# Altium schematic sheet Raspberry Pi.SchDoc
size A4; SheetNumber: 10; SheetTotal: 10
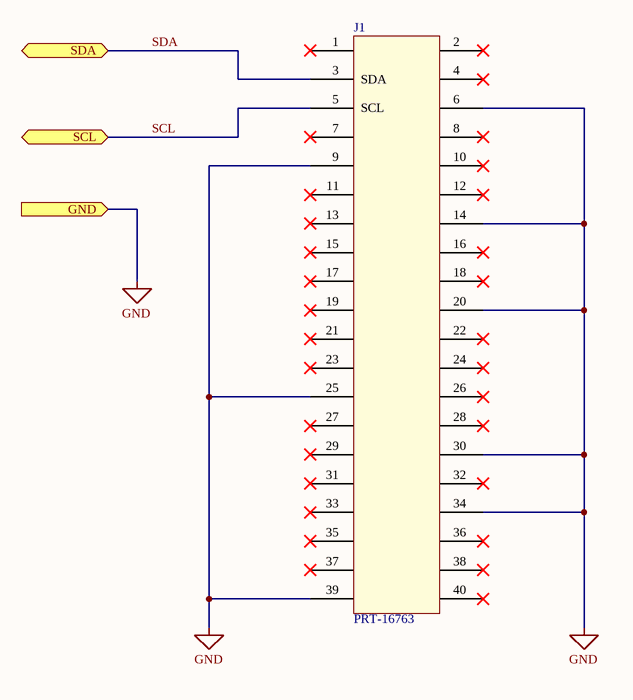
[diagram p0: Raspberry Pi.SchDoc]

## Parts
J1  PRT-16763  [FP-SFH11-PBPC-D20-ST-BK-MFG]

## Ports
GND (in, see Callisto Control Board[7A], 3V3 LDO[3B], INA219_CH1[1A], INA219_CH2[1B], INA219_CH3[1B], INA219_CH4[1B], INA219_CH5[1B], INA219_CH6[1B]), SCL (bidir, see Callisto Control Board[6A], INA219_CH1[1C], INA219_CH2[1C], INA219_CH3[1C], INA219_CH4[1C], INA219_CH5[1C], INA219_CH6[1C]), SDA (bidir, see Callisto Control Board[6A], INA219_CH1[1C], INA219_CH2[1C], INA219_CH3[1C], INA219_CH4[1C], INA219_CH5[1C], INA219_CH6[1C])

## Nets
GND: J1.6 J1.9 J1.14 J1.20 J1.25 J1.30 J1.34 J1.39 ; port GND
SCL: J1.5(SCL) ; port SCL
SDA: J1.3(SDA) ; port SDA

Not connected (* = marked no-connect by the designer): J1 1* 2* 4* 7* 8* 10* 11* 12* 13* 15* 16* 17* 18* 19* 21* 22* 23* 24* 26* 27* 28* 29* 31* 32* 33* 35* 36* 37* 38* 40*

## Library data of the parts
J1 = Raspberry Pi 3+ Header: Headers & Wire Housings Extended GPIO Female Header - 2x20 Pin (16mm/7.30mm)